# Altium schematic sheet A7_JTAG&CONFIG - Ⅱ.SchDoc
size A3
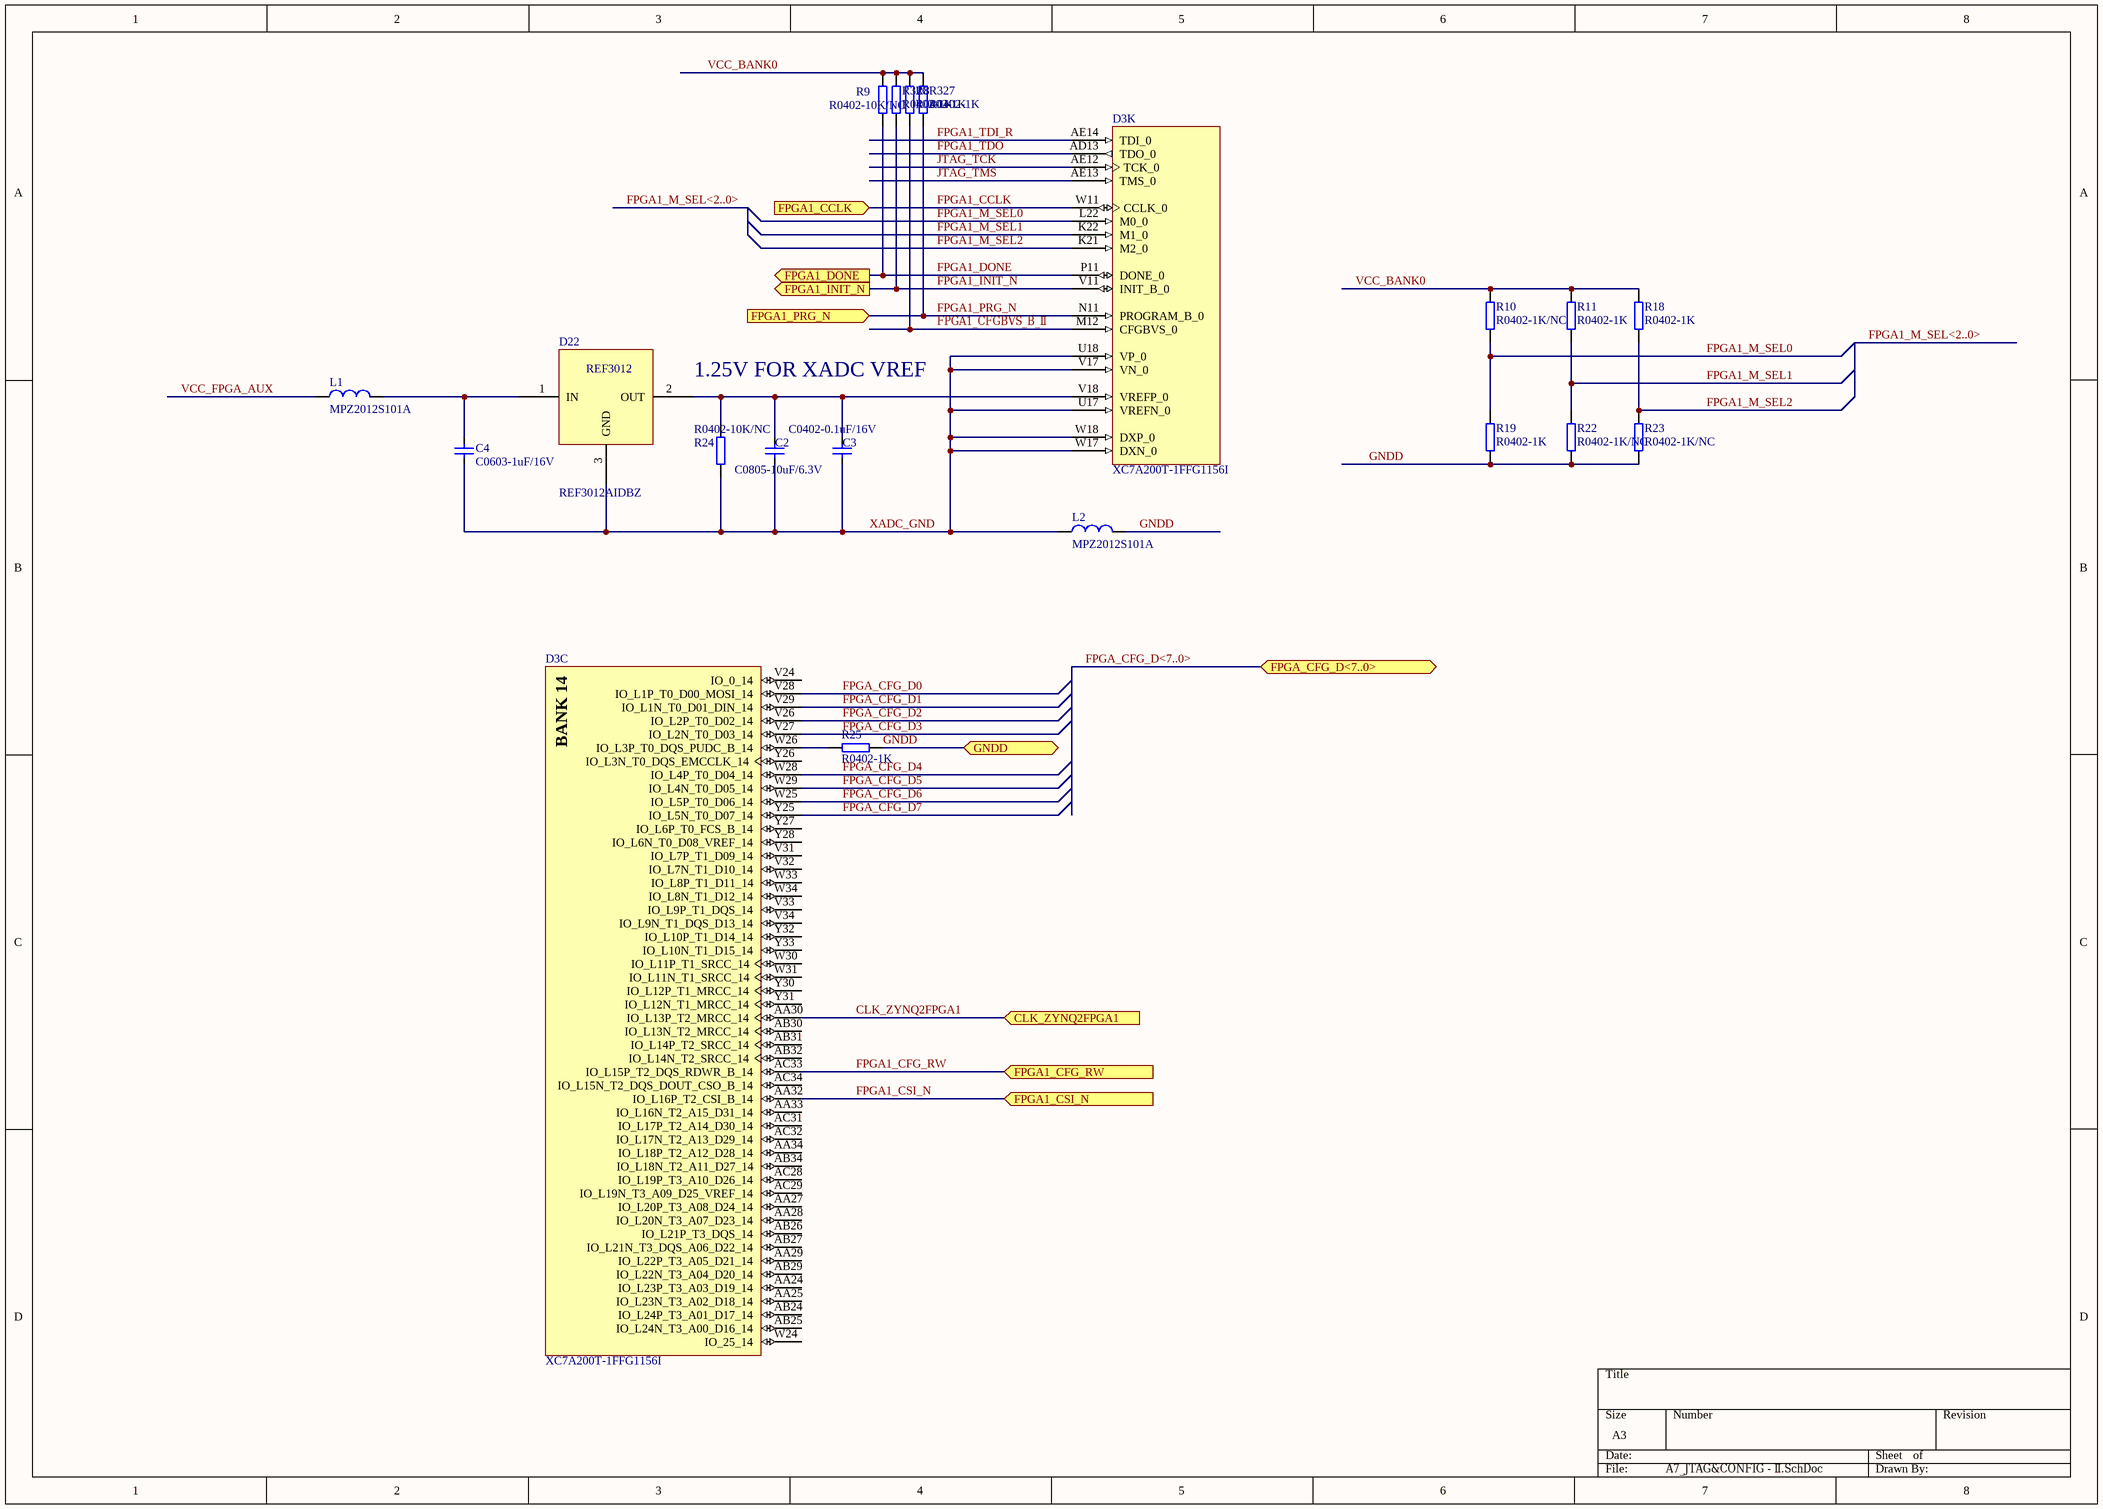
[diagram p0: A7_JTAG&CONFIG - Ⅱ.SchDoc]

## Parts
C2  C0805-10uF/6.3V  [C0805]
C3  C0402-0.1uF/16V  [C0402]
C4  C0603-1uF/16V  [C0603]
D3  XC7A200T-1FFG1156I  [FFG1156]  (parts C,K of 18)
D22  REF3012AIDBZ  [SOT-23]
L1  MPZ2012S101A  [R0805]
L2  MPZ2012S101A  [R0805]
R8  R0402-1K  [R0402]
R9  R0402-10K/NC  [R0402]
R10  R0402-1K/NC  [R0402]
R11  R0402-1K  [R0402]
R18  R0402-1K  [R0402]
R19  R0402-1K  [R0402]
R22  R0402-1K/NC  [R0402]
R23  R0402-1K/NC  [R0402]
R24  R0402-10K/NC  [R0402]
R25  R0402-1K  [R0402]
R326  R0402-1K  [R0402]
R327  R0402-1K  [R0402]

## Ports
CLK_ZYNQ2FPGA1 (in), FPGA1_CCLK (in), FPGA1_CFG_RW (in), FPGA1_CSI_N (in), FPGA1_DONE (out), FPGA1_INIT_N (out), FPGA1_PRG_N (in), FPGA_CFG_D<7..0>, GNDD

## Nets
CLK_ZYNQ2FPGA1: D3.AA30(IO_L13P_T2_MRCC_14) ; port CLK_ZYNQ2FPGA1
FPGA1_CCLK: D3.W11(CCLK_0) ; port FPGA1_CCLK
FPGA1_CFG_RW: D3.AC33(IO_L15P_T2_DQS_RDWR_B_14) ; port FPGA1_CFG_RW
FPGA1_CFGBVS_B_Ⅱ: D3.M12(CFGBVS_0) R8.1
FPGA1_CSI_N: D3.AA32(IO_L16P_T2_CSI_B_14) ; port FPGA1_CSI_N
FPGA1_DONE: D3.P11(DONE_0) R9.1 ; port FPGA1_DONE
FPGA1_INIT_N: D3.V11(INIT_B_0) R326.1 ; port FPGA1_INIT_N
FPGA1_M_SEL0: D3.L22(M0_0) R10.1 R19.2
FPGA1_M_SEL1: D3.K22(M1_0) R11.1 R22.2
FPGA1_M_SEL2: D3.K21(M2_0) R18.1 R23.2
FPGA1_PRG_N: D3.N11(PROGRAM_B_0) R327.1 ; port FPGA1_PRG_N
FPGA1_TDI_R: D3.AE14(TDI_0)
FPGA1_TDO: D3.AD13(TDO_0)
FPGA_CFG_D0: D3.V28(IO_L1P_T0_D00_MOSI_14)
FPGA_CFG_D1: D3.V29(IO_L1N_T0_D01_DIN_14)
FPGA_CFG_D2: D3.V26(IO_L2P_T0_D02_14)
FPGA_CFG_D3: D3.V27(IO_L2N_T0_D03_14)
FPGA_CFG_D4: D3.W28(IO_L4P_T0_D04_14)
FPGA_CFG_D5: D3.W29(IO_L4N_T0_D05_14)
FPGA_CFG_D6: D3.W25(IO_L5P_T0_D06_14)
FPGA_CFG_D7: D3.Y25(IO_L5N_T0_D07_14)
GNDD: L2.2 R19.1 R22.1 R23.1 R25.1 ; port GNDD
JTAG_TCK: D3.AE12(TCK_0)
JTAG_TMS: D3.AE13(TMS_0)
VCC_BANK0: R8.2 R9.2 R10.2 R11.2 R18.2 R326.2 R327.2
VCC_FPGA_AUX: L1.1
XADC_GND: C2.2 C3.2 C4.2 D3.U17(VREFN_0) D3.U18(VP_0) D3.V17(VN_0) D3.W17(DXN_0) D3.W18(DXP_0) D22.3(GND) L2.1 R24.2
NetC2_1: C2.1 C3.1 D3.V18(VREFP_0) D22.2(OUT) R24.1
NetC4_1: C4.1 D22.1(IN) L1.2
NetD3_W26: D3.W26(IO_L3P_T0_DQS_PUDC_B_14) R25.2

Not connected (* = marked no-connect by the designer): D3 AA24(IO_L23P_T3_A03_D19_14) AA25(IO_L23N_T3_A02_D18_14) AA27(IO_L20P_T3_A08_D24_14) AA28(IO_L20N_T3_A07_D23_14) AA29(IO_L22P_T3_A05_D21_14) AA33(IO_L16N_T2_A15_D31_14) AA34(IO_L18P_T2_A12_D28_14) AB24(IO_L24P_T3_A01_D17_14) AB25(IO_L24N_T3_A00_D16_14) AB26(IO_L21P_T3_DQS_14) AB27(IO_L21N_T3_DQS_A06_D22_14) AB29(IO_L22N_T3_A04_D20_14) AB30(IO_L13N_T2_MRCC_14) AB31(IO_L14P_T2_SRCC_14) AB32(IO_L14N_T2_SRCC_14) AB34(IO_L18N_T2_A11_D27_14) AC28(IO_L19P_T3_A10_D26_14) AC29(IO_L19N_T3_A09_D25_VREF_14) AC31(IO_L17P_T2_A14_D30_14) AC32(IO_L17N_T2_A13_D29_14) AC34(IO_L15N_T2_DQS_DOUT_CSO_B_14) V24(IO_0_14) V31(IO_L7P_T1_D09_14) V32(IO_L7N_T1_D10_14) V33(IO_L9P_T1_DQS_14) V34(IO_L9N_T1_DQS_D13_14) W24(IO_25_14) W30(IO_L11P_T1_SRCC_14) W31(IO_L11N_T1_SRCC_14) W33(IO_L8P_T1_D11_14) W34(IO_L8N_T1_D12_14) Y26(IO_L3N_T0_DQS_EMCCLK_14) Y27(IO_L6P_T0_FCS_B_14) Y28(IO_L6N_T0_D08_VREF_14) Y30(IO_L12P_T1_MRCC_14) Y31(IO_L12N_T1_MRCC_14) Y32(IO_L10P_T1_D14_14) Y33(IO_L10N_T1_D15_14)

## Buses and harness runs
bus FPGA1_M_SEL<2..0>
bus FPGA_CFG_D<7..0> = port FPGA_CFG_D<7..0>

## Notes on the sheet
- 1.25V FOR XADC VREF
- (in symbol XC7A200T-1FFG1156I, part C) BANK 14

## Library data of the parts
C2 = C1210-22uF/16V: Part_number: C0805-10uF/6.3V; Part_type: CAP; Value: C0805-10uF/6.3V; Schematic_Part: CAP; PCB_Footprint: C0805
C3 = C0402-0.1uF/16V: X7R; Manufacturer: SAMSUNG; Manufacturer_p/n: CL05X7R104KO5NNN; Part_number: C0402-0.1uF/16V; Part_type: CAP; Value: C0402-0.1uF/16V; temperature: -55℃\+125℃; Schematic_Part: CAP; PCB_Footprint: C0402; datasheet: #DataSheet\C_Samsung_General Capacitors.pdf#
C4 = C0603-100nF/16V: X7R; Part_number: C0603-1uF/16V; Part_type: CAP; Value: C0603-1uF/16V; temperature: -55℃\+125℃; Schematic_Part: CAP; PCB_Footprint: C0603
D3 = XC7A200T-1FFG1156I: Artix-7 FPGA, 500 User I/Os, 16 GTP, 1156-Ball BGA, Speed Grade 1, Industrial Grade, Pb-Free; Manufacturer: Xilinx; Block RAM Blocks (18Kb): 730; Block RAM Blocks (36Kb): 365; Block RAM Blocks (Max Kb): 13140; CLBs (Slices): 33650; Clock Mgmt Tiles (CMTs): 10; DSP48E1 Slices: 740; Logic Cells: 215360; Max User I/O: 500; Speed Grade: -1; DatasheetVersion: v1.12; PackageVersion: Rev 1.8; PackageReference: FFG1156; PackageDescription: Flip-Chip BGA, Body 35 x 35 mm, 1.0 mm Pitch; CLBs (Max Distributed RAM Kb): 2888; Generic Part Number: XC7A200T; RoHS: Pb-Free; Mounting Technology: Surface Mount; Code_JEDEC: MS-034-AAR-1; PartNumber: XC7A200T-1FFG1156I; ComponentLink1Description: Datasheet; ComponentLink1URL: http://www.xilinx.com/support/documentation/data_sheets/ds180_7Series_Overview.pdf; ComponentLink2Description: Package Specification; ComponentLink2URL: http://www.xilinx.com/support/documentation/user_guides/ug475_7Series_Pkg_Pinout.pdf; ComponentLink3Description: DC and Switching Characteristics; ComponentLink3URL: http://www.xilinx.com/support/documentation/data_sheets/ds181_Artix_7_Data_Sheet.pdf; ComponentLink4Description: Package File; ComponentLink4URL: http://www.xilinx.com/support/packagefiles/a7packages/xc7a200tfbg676pkg.txt; ComponentLink5Description: Packaging and Pinout; ComponentLink5URL: http://www.xilinx.com/support/documentation/user_guides/ug475_7Series_Pkg_Pinout.pdf
L1 L2 = FB0805-330R@100MHz: Manufacturer: TDK; Part_number: MPZ2012S101A; Part_type: BEAD; temperature: -55℃\+125℃; Value1: 330R@100MHz; Schematic_Part: BEAD; PCB_Footprint: R0805; Manufacturer_p/n: MPZ2012S101A
R8-R11 R18 R19 R22-R25 R326 R327 = R0402-10K: Manufacturer: SAMSUNG; Part_type: RES; Schematic_Part: RES; PCB_Footprint: R0402
  R8 R11 R18 R19 R25 R326 R327: Part_number: R0402-1K; Value: R0402-1K
  R9 R24: Part_number: R0402-10K/NC; Value: R0402-10K/NC
  R10 R22 R23: Part_number: R0402-1K/NC; Value: R0402-1K/NC
D22 = REF3012AIDBZ: Part_number: REF3012AIDBZ